# Altium schematic sheet 1_P1.schdoc
size 309 x 223 mm; Symbol: Sheet-Symbol_A4; Device: Sheet-Symbol_A4; @Page Name: P1; @Create Date: 2023-06-18; @Page Count: 1; @Page No: 1; @Project Name: AD_Library; @Schematic Name: Schematic1; @Update Date: 2023-06-18; Company: 嘉立创EDA; Page Size: A4; Version: V1.0
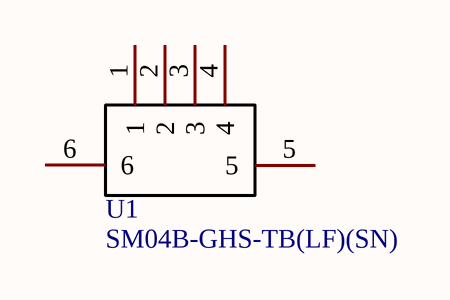
[diagram p0: 1_P1.schdoc]

## Parts
U1  SM04B-GHS-TB(LF)(SN)  [CONN-SMD_4P-P1.25_SM04B-GHS-TB-LF-SN]

## Nets

Not connected (* = marked no-connect by the designer): U1 1 2 3 4 5 6

## Notes on the sheet
- 1
- 2
- 3
- 4
- 5
- 6
- A
- B
- C
- Schematic
- Schematic1
- Create Date
- Update Date
- 2023-06-18
- Reviewed
- Drawed
- Page
- P1
- Part Number
- AD_Library
- D
- VER
- SIZE
- PAGE
- OF
- V1.0
- A4
- 嘉立创EDA

## Library data of the parts
U1 = SM04B-GHS-TB(LF)(SN): 参考系列:GH;间距:1.25mm;插针结构:1x4P;排数:1;每排PIN数:4;行距:-;安装方式:-;触头材质:磷青铜;; Manufacturer: JST; Add into BOM: yes; Reference Series: GH; Pitch: 1.25mm; Pins Structure: 1x4P; Number of PINs Per Row: 4; Name: SM04B-GHS-TB(LF)(SN); Symbol: SM04B-GHS-TB(LF)(SN); Device: SM04B-GHS-TB(LF)(SN); LCSC Part Name: GH 1.25mm 1x4P; Supplier Part: C189895; Manufacturer Part: SM04B-GHS-TB(LF)(SN); Supplier Footprint: SMD,P=1.25mm; JLCPCB Part Class: 扩展库; Datasheet: https://atta.szlcsc.com/upload/public/pdf/source/20180327/C189895_E152F1273677DB005E39DD42455B7B10.pdf; Supplier: LCSC; Convert to PCB: yes; Number of Rows: 1; Row Spacing: -; Mounting Style: -; Contact Material: 磷青铜